# EasyEDA Pro project leaf_chaser.epro

# Schematic Schematic1
Board Name: Board1; Create Date: 2026-05-01; Page Name: P1; Project Name: leaf-chaser; Schematic Name: Schematic1; Update Date: 2026-05-01; Company: EasyEDA.com; Page Size: A4; Version: V1.0
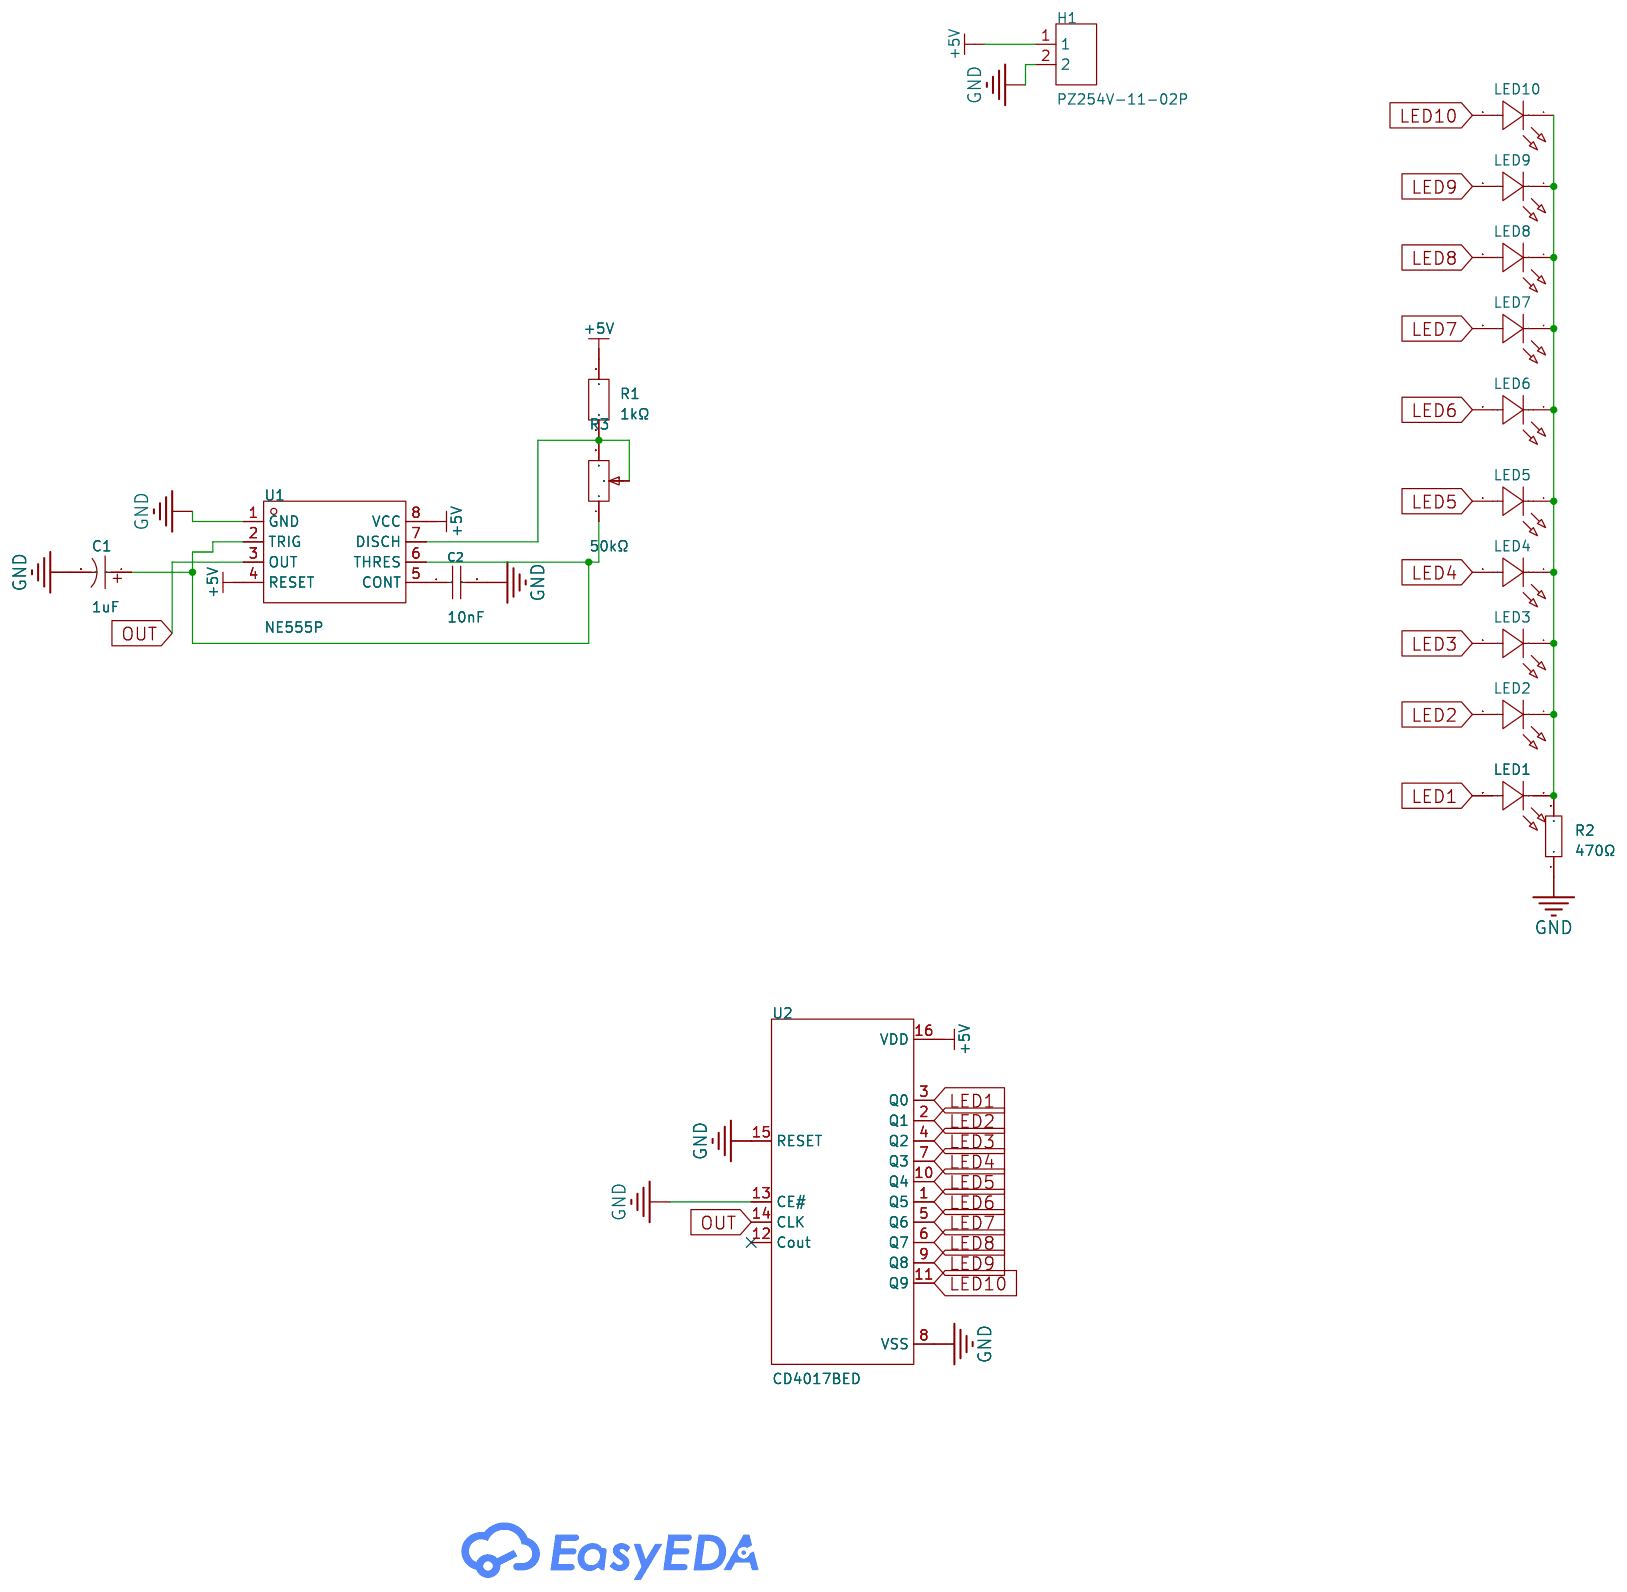
[diagram p0: schematic sheet]

## Parts
C1  1uF  [CAP-TH_BD4.0-P1.50-D0.8-FD]
C2  10nF  [C0603]
H1  PZ254V-11-02P  [HDR-TH_2P-P2.54-V-M]
LED1  XL-302SURD  [LED-TH_BD3.8-P2.54-RD]
LED2  XL-302SURD  [LED-TH_BD3.8-P2.54-RD]
LED3  XL-302SURD  [LED-TH_BD3.8-P2.54-RD]
LED4  XL-302SURD  [LED-TH_BD3.8-P2.54-RD]
LED5  XL-302SURD  [LED-TH_BD3.8-P2.54-RD]
LED6  XL-302SURD  [LED-TH_BD3.8-P2.54-RD]
LED7  XL-302SURD  [LED-TH_BD3.8-P2.54-RD]
LED8  XL-302SURD  [LED-TH_BD3.8-P2.54-RD]
LED9  XL-302SURD  [LED-TH_BD3.8-P2.54-RD]
LED10  XL-302SURD  [LED-TH_BD3.8-P2.54-RD]
R1  1kΩ  [RES-TH_BD2.7-L6.2-P10.20-D0.4]
R2  470Ω  [RES-TH_BD2.3-L6.5-P10.50-D0.5]
R3  50kΩ  [RES-ADJ-TH_3296W]
U1  NE555P  [DIP-8_L9.8-W6.6-P2.54-LS7.6-BL]
U2  CD4017BED  [PDIP-16_L19.7-W6.6-P2.54-LS7.6-BL]

## Library data of the parts
C1 = KS1H010MB070A00CV0: Capacitance:1uF Tolerance:±20% Tolerance:±20% Voltage Rating:50V Ripple Current:10mA@120Hz Equivalent Series Resistance(ESR):- Pin Spacing:1.5mm Diameter:4mm Height - Seated (Max):7mm Lifetime:1000hrs@105℃; LCSC Part Name: 1uF ±20% 50V; Supplier Part: C216323; Manufacturer: HUAWEI(华威集团); Supplier Footprint: 插件,D4xL7mm; JLCPCB Part Class: Extended Part; Datasheet: https://atta.szlcsc.com/upload/public/pdf/source/20180905/C271443_A6F66C79EF84E009A061F1FE7B9BC844.pdf; Supplier: LCSC; Tolerance: ±20%; Voltage Rating: 50V; Ripple Current: 10mA@120Hz; Pin Spacing: 1.5mm; Diameter: 4mm; Height - Seated (Max): 7mm; Lifetime: 1000hrs@105℃
C2 = CC0603KRX7R9BB103: Capacitance:10nF Tolerance:±10% Tolerance:±10% Voltage Rating:50V Temperature Coefficient:X7R; LCSC Part Name: 10nF ±10% 50V; Supplier Part: C100042; Manufacturer: YAGEO(国巨); Supplier Footprint: 0603; Datasheet: https://item.szlcsc.com/datasheet/CC0603KRX7R9BB103/101256.html; Supplier: LCSC; Tolerance: ±10%; Voltage Rating: 50V; Temperature Coefficient: X7R
H1 = PZ254V-11-02P: Pin Structure:1x2P Pitch:2.54mm Row Spacing:- Circluar Pins/Square Pins:Pin Header Mounting Type:Through Hole Number of Rows:1 Number of Pins:2P Current Rating:3A Voltage Rating (Max):250V Length of Mating Pin:6mm Insulation Height:2.5mm Length of End Con; LCSC Part Name: 1x2P 间距:2.54mm 方针 直插; Supplier Part: C492401; Manufacturer: XFCN(兴飞); Supplier Footprint: 插件,P=2.54mm; JLCPCB Part Class: Extended Part; Datasheet: https://item.szlcsc.com/datasheet/PZ254V-11-02P/502957.html; Supplier: LCSC; Pin Structure: 1x2P; Pitch: 2.54mm; Circluar Pins/Square Pins: Pin Header; Mounting Type: Through Hole; Number of Rows: 1; Number of Pins: 2P; Current Rating: 3A; Voltage Rating (Max): 250V; Length of Mating Pin: 6mm; Insulation Height: 2.5mm; Length of End Connection Pin: 3mm; Contact Material: Brass; Operating Temperature: -40℃~+105℃; Color: Black
LED1-LED10 = XL-302SURD: Lamp Holder Type:3mm Round Lens Illumination Color:Red Voltage - Forward(Vf):2.2V Voltage - Forward(Vf):2.2V Power(Watts):50mW Forward Current:20mA Wavelength - Dominant:620nm~630nm Wavelength - Dominant:620nm~630nm Peak Wavelength:625nm Diode Configurati; LCSC Part Name: 3mm圆形灯头 红色; Supplier Part: C2895470; Manufacturer: XINGLIGHT(成兴光); Supplier Footprint: 插件,D=3mm; JLCPCB Part Class: Extended Part; Datasheet: https://item.szlcsc.com/datasheet/XL-302SURD/3136185.html; Supplier: LCSC; Lamp Holder Type: 3mm Round Lens; Illumination Color: Red; Voltage - Forward(Vf): 2.2V; Power(Watts): 50mW; Forward Current: 20mA; Wavelength - Dominant: 620nm~630nm; Peak Wavelength: 625nm; Lens Color: Red Lens; Luminous Intensity: 1cd; Viewing Angle: 35°; Operating Temperature: -20℃~+85℃
R1 = MF1/4W-1K±1%-ST52: Type:Metal Film Resistor Resistance:1kΩ Tolerance:±1% Tolerance:±1% Voltage-Supply(Max):250V Power(Watts):250mW Temperature Coefficient:±100ppm/℃ Temperature Coefficient:±100ppm/℃ Operating Temperature:-55℃~+155℃ Operating Temperature:-55℃~+155℃; LCSC Part Name: 金属膜电阻 1kΩ ±1% 250mW; Supplier Part: C2903245; Manufacturer: VO(翔胜); Supplier Footprint: 插件,D2.7xL6.2mm; Datasheet: https://item.szlcsc.com/datasheet/MF1%252F4W-1K%25C2%25B11%2525-ST52/3158996.html; Supplier: LCSC; Type: Metal Film Resistor; Tolerance: ±1%; Voltage-Supply(Max): 250V; Power(Watts): 250mW; Temperature Coefficient: ±100ppm/℃; Operating Temperature: -55℃~+155℃
R2 = MF1/2WS-470Ω±1% T: Type:Metal Film Resistor Resistance:470Ω Tolerance:±1% Tolerance:±1% Voltage-Supply(Max):250V Power(Watts):500mW Temperature Coefficient:±100ppm/℃ Temperature Coefficient:±100ppm/℃ Operating Temperature:-55℃~+155℃ Operating Temperature:-55℃~+155℃; LCSC Part Name: 470Ω ±1% 500mW 金属膜电阻 小体积,p;-[[圆柱直插; Supplier Part: C129899; Manufacturer: CCO(千志电子); Supplier Footprint: 插件,D2.3xL6.5mm; JLCPCB Part Class: Extended Part; Datasheet: https://item.szlcsc.com/datasheet/MF1%252F2WS-470%25CE%25A9%25C2%25B11%2525%2520T/141186.html; Supplier: LCSC; Type: Metal Film Resistor; Tolerance: ±1%; Voltage-Supply(Max): 250V; Power(Watts): 500mW; Temperature Coefficient: ±100ppm/℃; Operating Temperature: -55℃~+155℃
R3 = 3296W-1-503LF_C49190466: Resistance:50kΩ Tolerance:±10% Tolerance:±10% Power(Watts):500mW Temperature Coefficient:±150ppm/℃ Temperature Coefficient:±150ppm/℃ Number of Turns:28; LCSC Part Name: 玻璃釉预调电位器; Supplier Part: C49190466; Manufacturer: JIERR(捷而瑞); Manufacturer Part: 3296W-1-503LF; Supplier Footprint: 插件-3P,9.5x4.9mm; Datasheet: https://item.szlcsc.com/datasheet/3296W-1-503LF/51587059.html; Supplier: LCSC; Tolerance: ±10%; Power(Watts): 500mW; Temperature Coefficient: ±150ppm/℃; Number of Turns: 28
U1 = NE555P: Timer Number:1 Voltage - Supply:4.5V~16V Voltage - Supply:4.5V~16V Output Current:200mA Supply Current:2mA Operating Temperature:0℃~+70℃ Operating Temperature:0℃~+70℃ Features:占空比可调振荡；复位功能; LCSC Part Name: 555精密定时器; Supplier Part: C46749; Manufacturer: TI(德州仪器); Supplier Footprint: DIP-8; JLCPCB Part Class: Extended Part; Datasheet: https://www.ti.com/cn/lit/gpn/ne555; Supplier: LCSC; Timer Number: 1; Voltage - Supply: 4.5V~16V; Output Current: 200mA; Supply Current: 2mA; Operating Temperature: 0℃~+70℃; Features: 占空比可调振荡；复位功能
U2 = CD4017BED: Supplier Part: C51898328; Manufacturer: GMIC(绿微); Supplier Footprint: DIP-16; JLCPCB Part Class: Extended Part; Datasheet: https://item.szlcsc.com/datasheet/CD4017BED/54583753.html; Supplier: LCSC

## Nets
+5V: H1.1 R1.2 U1.4(RESET) U1.8(VCC) U2.16(VDD)
GND: C1.2 C2.2 H1.2 R2.1 U1.1(GND) U2.8(VSS) U2.13(CE#) U2.15(RESET)
LED1: LED1.2(A) U2.3(Q0)
LED2: LED2.2(A) U2.2(Q1)
LED3: LED3.2(A) U2.4(Q2)
LED4: LED4.2(A) U2.7(Q3)
LED5: LED5.2(A) U2.10(Q4)
LED6: LED6.2(A) U2.1(Q5)
LED7: LED7.2(A) U2.5(Q6)
LED8: LED8.2(A) U2.6(Q7)
LED9: LED9.2(A) U2.9(Q8)
LED10: LED10.2(A) U2.11(Q9)
OUT: U1.3(OUT) U2.14(CLK)
$1N2053: C1.1 R3.1 U1.2(TRIG) U1.6(THRES)
$1N2105: C2.1 U1.5(CONT)
$1N2159: R1.1 R3.2 R3.3 U1.7(DISCH)
$1N2664: LED1.1(K) LED2.1(K) LED3.1(K) LED4.1(K) LED5.1(K) LED6.1(K) LED7.1(K) LED8.1(K) LED9.1(K) LED10.1(K) R2.2

Not connected (* = marked no-connect by the designer): U2 12(Cout)*

# Board PCB1
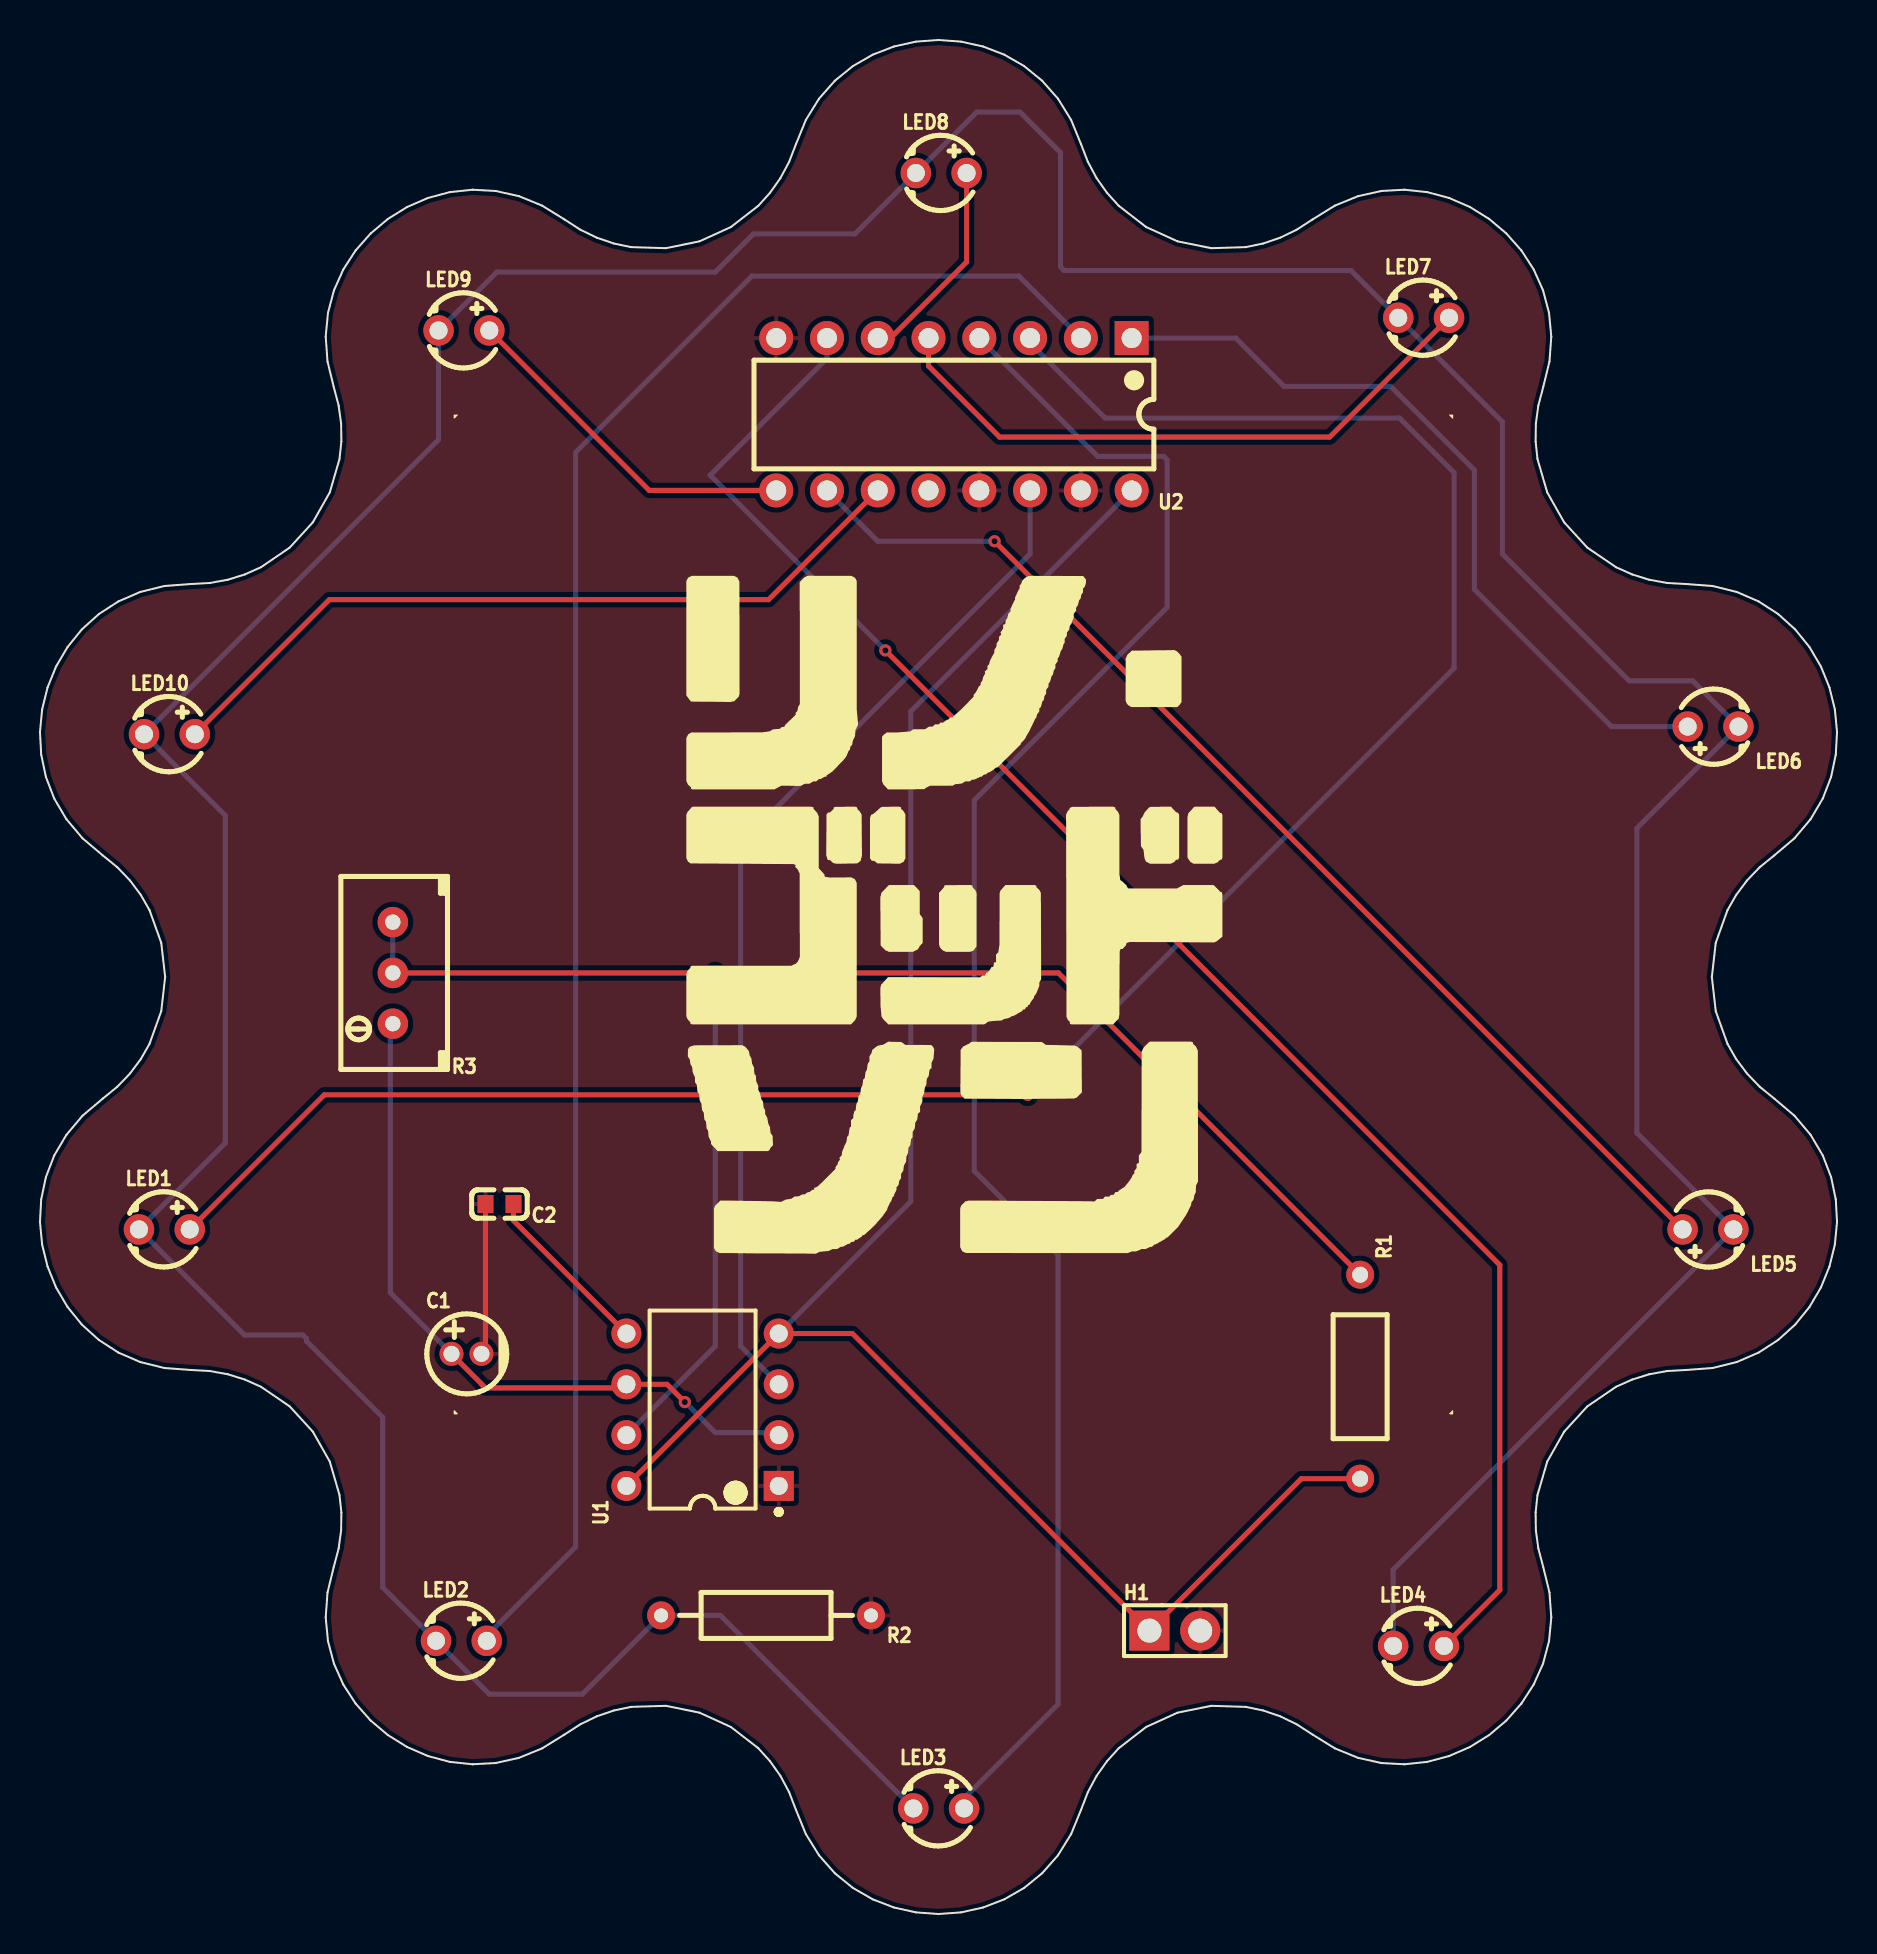
[diagram p1: board, top side]
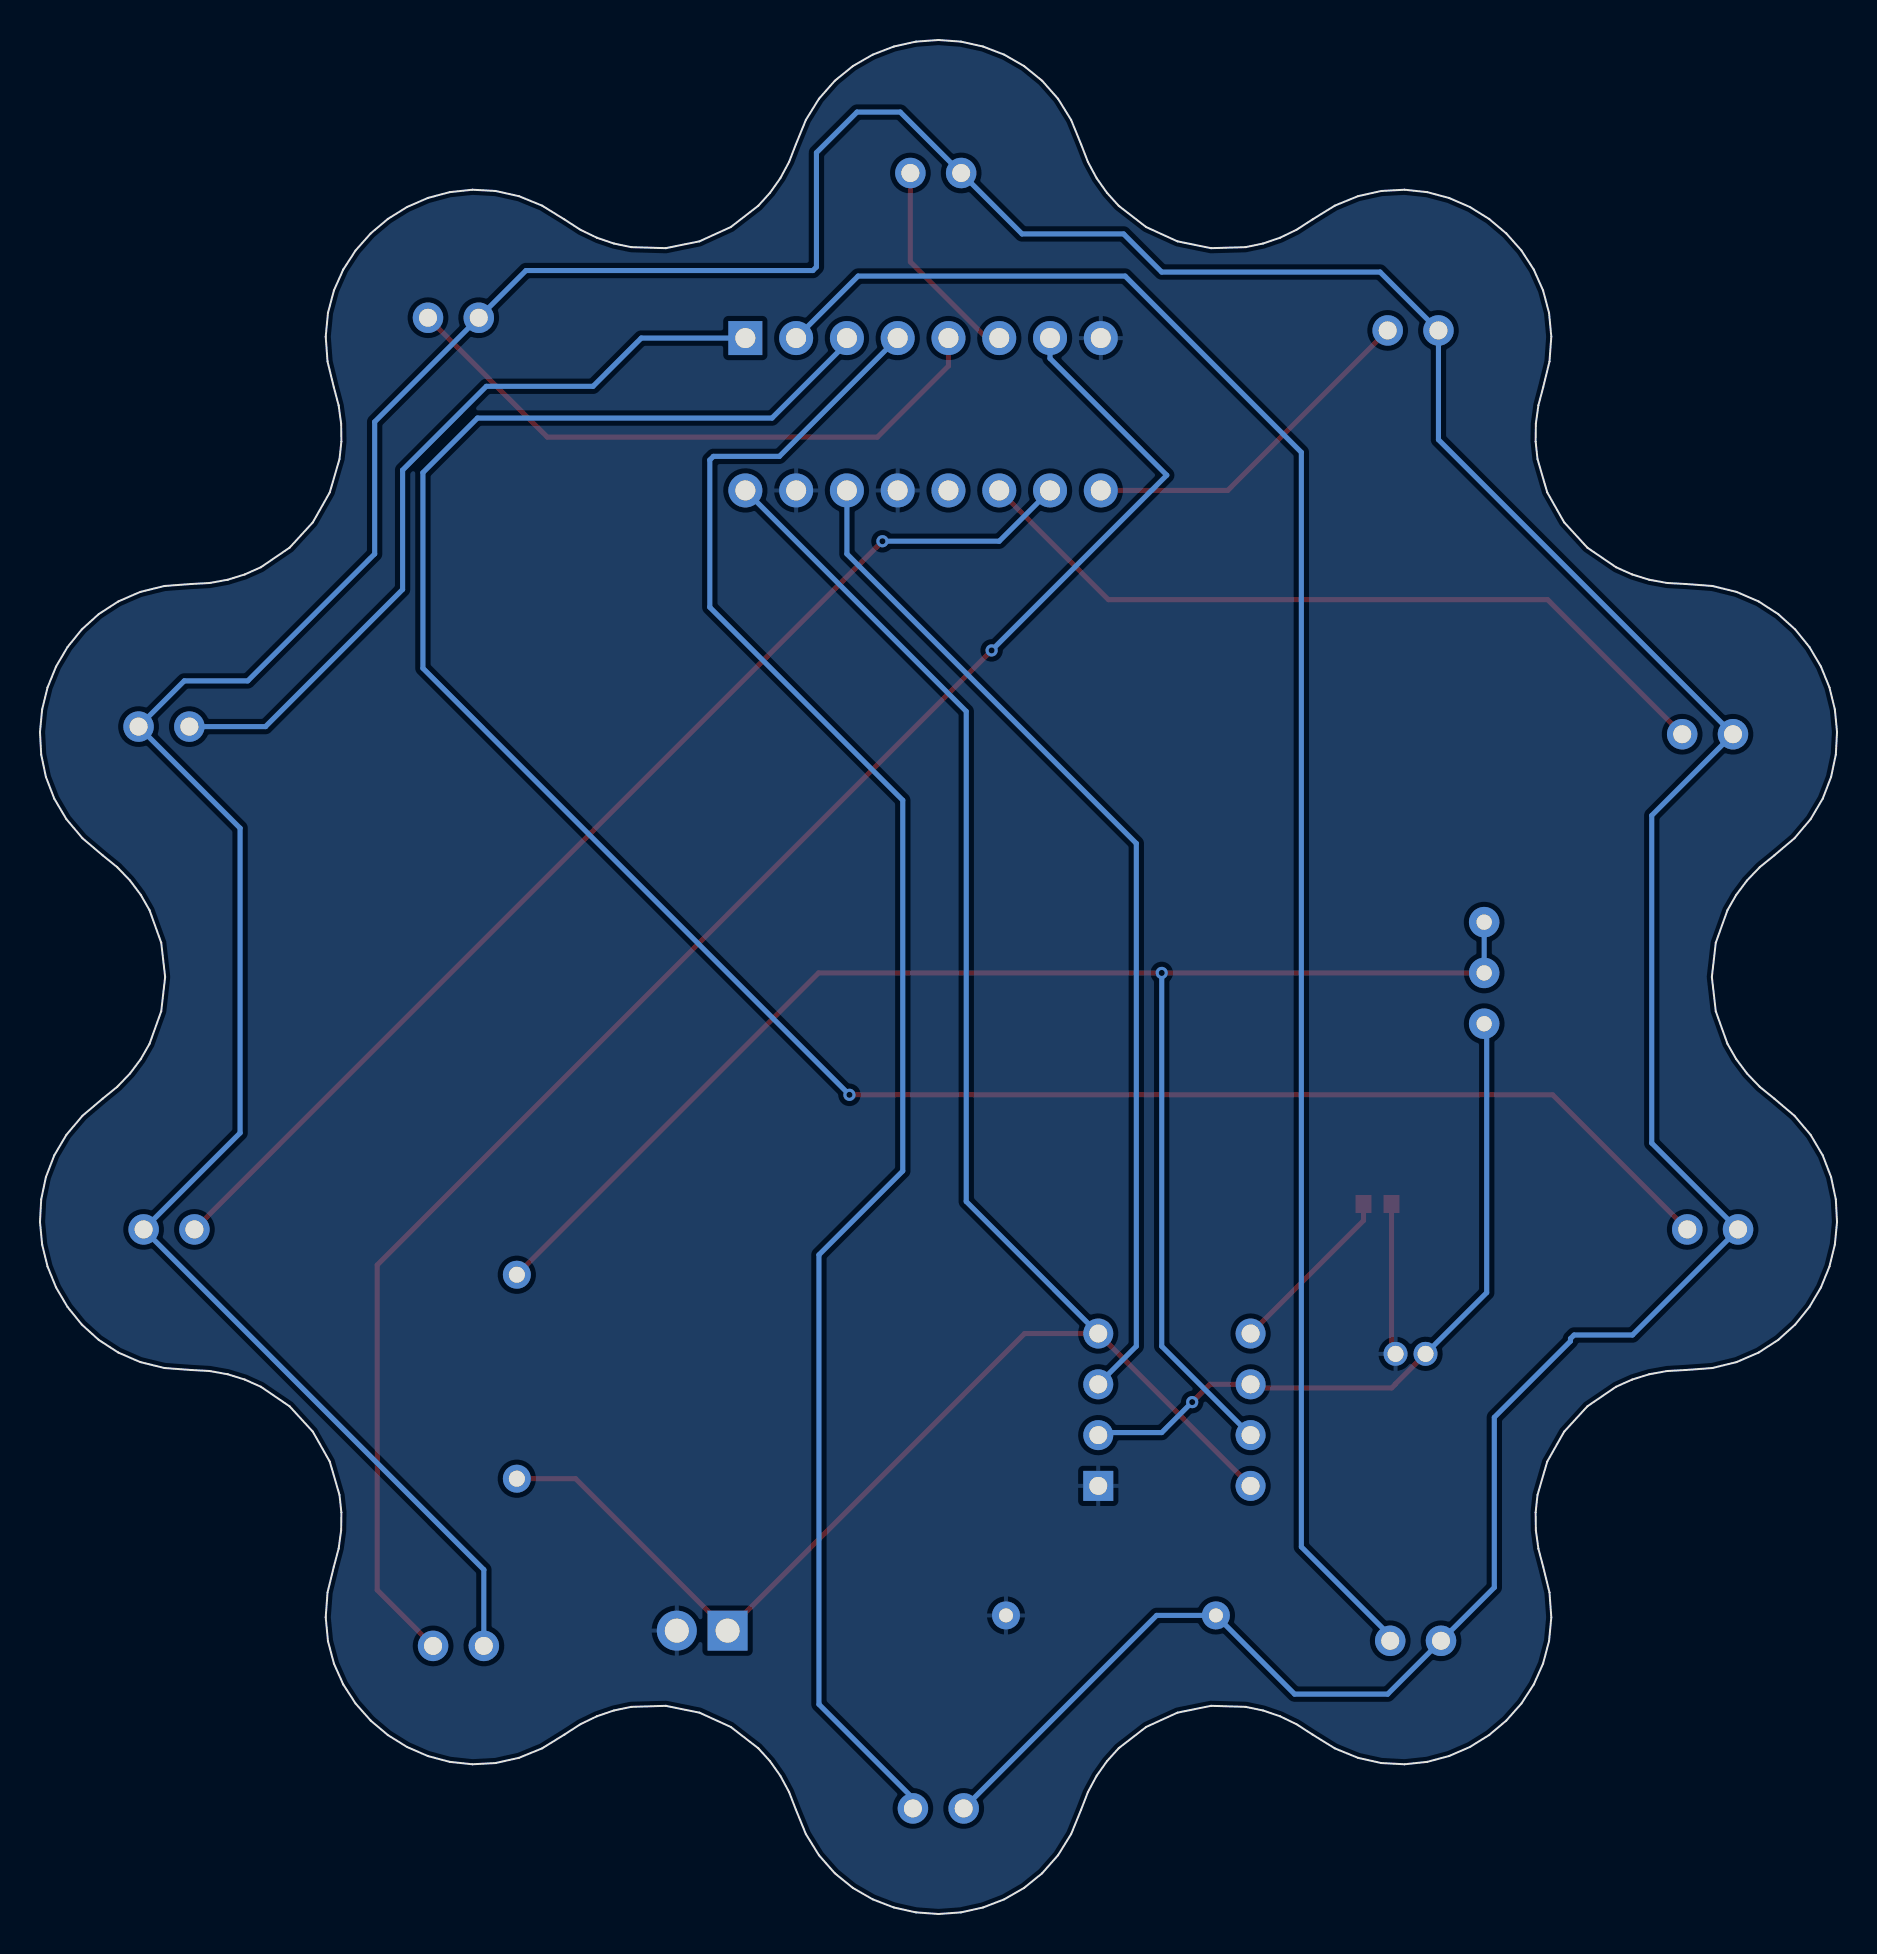
[diagram p2: board, bottom side, seen from below]

Outline 89.89 x 93.72 mm; copper layers: Top Layer, Bottom Layer. Coordinates in mm from the lower left corner of the outline.
Outline path: 0,59.12 0.11,60.24 0.38,61.34 0.8,62.39 1.38,63.36 2.09,64.24 2.94,65.01 3.92,65.64 5.02,66.12 6.23,66.42 7.55,66.51 8.49,66.56 9.39,66.73 10.25,66.99 11.05,67.35 12.49,68.33 13.65,69.6 14.5,71.1 14.98,72.76 15.08,73.64 15.06,74.54 14.94,75.44 14.7,76.36 14.38,77.64 14.29,78.88 14.41,80.07 14.7,81.2 15.17,82.24 15.79,83.2 16.54,84.04 17.4,84.77 18.36,85.37 19.4,85.82 20.49,86.11 21.63,86.23 22.8,86.17 23.96,85.91 25.12,85.44 26.24,84.74 27.03,84.23 27.86,83.83 28.71,83.54 29.57,83.36 31.31,83.31 32.99,83.65 34.56,84.37 35.93,85.43 36.52,86.08 37.04,86.81 37.47,87.62 37.81,88.5 38.31,89.73 38.97,90.79 39.76,91.68 40.66,92.42 41.66,92.99 42.72,93.39 43.82,93.64 44.95,93.72 46.07,93.64 47.18,93.39 48.24,92.99 49.23,92.42 50.13,91.68 50.92,90.79 51.58,89.73 52.08,88.5 52.42,87.62 52.85,86.81 53.37,86.08 53.96,85.43 55.34,84.37 56.9,83.65 58.59,83.31 60.32,83.36 61.18,83.54 62.03,83.83 62.86,84.23 63.65,84.74 64.78,85.44 65.93,85.91 67.1,86.17 68.26,86.23 69.4,86.11 70.49,85.82 71.53,85.37 72.49,84.77 73.35,84.04 74.1,83.2 74.72,82.24 75.19,81.2 75.49,80.07 75.6,78.88 75.51,77.64 75.19,76.36 74.95,75.44 74.83,74.54 74.82,73.64 74.91,72.76 75.4,71.1 76.24,69.6 77.41,68.33 78.84,67.35 79.64,66.99 80.5,66.73 81.4,66.56 82.35,66.51 83.66,66.42 84.88,66.12 85.97,65.64 86.95,65.01 87.8,64.24 88.51,63.36 89.09,62.39 89.51,61.34 89.78,60.24 89.89,59.12 89.83,57.99 89.6,56.86 89.18,55.78 88.57,54.75 87.76,53.8 86.75,52.94 86.02,52.35 85.39,51.69 84.85,50.97 84.41,50.2 83.83,48.57 83.63,46.86 83.83,45.15 84.41,43.52 84.85,42.75 85.39,42.03 86.02,41.37 86.75,40.78 87.76,39.92 88.57,38.97 89.18,37.94 89.6,36.86 89.83,35.74 89.89,34.6 89.78,33.48 89.51,32.38 89.09,31.33 88.51,30.36 87.8,29.48 86.95,28.71 85.97,28.08 84.88,27.6 83.66,27.31 82.35,27.21 81.4,27.16 80.5,26.99 79.64,26.73 78.84,26.37 77.41,25.39 76.24,24.12 75.4,22.62 74.91,20.96 74.82,20.08 74.83,19.18 74.95,18.28 75.19,17.36 75.51,16.08 75.6,14.84 75.49,13.65 75.19,12.52 74.72,11.48 74.1,10.52 73.35,9.68 72.49,8.95 71.53,8.35 70.49,7.9 69.4,7.61 68.26,7.49 67.1,7.55 65.93,7.81 64.78,8.28 63.65,8.98 62.86,9.49 62.03,9.89 61.18,10.18 60.32,10.36 58.59,10.41 56.9,10.07 55.34,9.35 53.96,8.29 53.37,7.64 52.85,6.91 52.42,6.1 52.08,5.22 51.58,4 50.92,2.94 50.13,2.04 49.23,1.3 48.24,0.73 47.18,0.33 46.07,0.08 44.95,0 43.82,0.08 42.72,0.33 41.66,0.73 40.66,1.3 39.76,2.04 38.97,2.94 38.31,4 37.81,5.22 37.47,6.1 37.04,6.91 36.52,7.64 35.93,8.29 34.56,9.35 32.99,10.07 31.31,10.41 29.57,10.36 28.71,10.18 27.86,9.89 27.03,9.49 26.24,8.98 25.12,8.28 23.96,7.81 22.8,7.55 21.63,7.49 20.49,7.61 19.4,7.9 18.36,8.35 17.4,8.95 16.54,9.68 15.79,10.52 15.17,11.48 14.7,12.52 14.41,13.65 14.29,14.84 14.38,16.08 14.7,17.36 14.94,18.28 15.06,19.18 15.08,20.08 14.98,20.96 14.5,22.62 13.65,24.12 12.49,25.39 11.05,26.37 10.25,26.73 9.39,26.99 8.49,27.16 7.55,27.21 6.23,27.31 5.02,27.6 3.92,28.08 2.94,28.71 2.09,29.48 1.38,30.36 0.8,31.33 0.38,32.38 0.11,33.48 0,34.6 0.06,35.74 0.3,36.86 0.71,37.94 1.32,38.97 2.13,39.92 3.14,40.78 3.87,41.37 4.5,42.03 5.04,42.75 5.48,43.52 6.07,45.15 6.26,46.86 6.07,48.57 5.48,50.2 5.04,50.97 4.5,51.69 3.87,52.35 3.14,52.94 2.13,53.8 1.32,54.75 0.71,55.78 0.3,56.86 0.06,57.99 0,59.12
Stack: Top Layer 0.035mm / Dielectric1 1.51mm FR4 er 4.5 / Bottom Layer 0.035mm

## Design rules (mm)
template: JLCPCB Capability(Two Layers Board)
spacing copperThickness1oz (default): track to track 0.102, other pairs 0.152 to 0.3
spacing copperThickness2oz: track to track 0.203, other pairs 0.152 to 0.3
track width copperThickness1oz (default): min 0.127, default 0.254, max 2.54
track width copperThickness2oz: min 0.203, default 0.254, max 2.54
differential pair differentialPair (default): width min 0.127, default 0.254, max 2.54; gap min 0.152, default 0.152
via viaSize (default): diameter min 0.5, default 0.61, max 10; hole min 0.3, default 0.305, max 6.3

## Placement (name value [footprint] x y rotation side)
C1  1uF  [CAP-TH_BD4.0-P1.50-D0.8-FD]  21.33 28.01 0 top
C2  10nF  [C0603]  22.98 35.51 180 top
H1  PZ254V-11-02P  [HDR-TH_2P-P2.54-V-M]  56.77 14.17 0 top
LED1  XL-302SURD  [LED-TH_BD3.8-P2.54-RD]  6.22 34.24 0 top
LED2  XL-302SURD  [LED-TH_BD3.8-P2.54-RD]  21.08 13.66 0 top
LED3  XL-302SURD  [LED-TH_BD3.8-P2.54-RD]  44.96 5.28 0 top
LED4  XL-302SURD  [LED-TH_BD3.8-P2.54-RD]  68.96 13.41 0 top
LED5  XL-302SURD  [LED-TH_BD3.8-P2.54-RD]  83.44 34.24 180 top
LED6  XL-302SURD  [LED-TH_BD3.8-P2.54-RD]  83.69 59.38 180 top
LED7  XL-302SURD  [LED-TH_BD3.8-P2.54-RD]  69.21 79.83 0 top
LED8  XL-302SURD  [LED-TH_BD3.8-P2.54-RD]  45.08 87.07 0 top
LED9  XL-302SURD  [LED-TH_BD3.8-P2.54-RD]  21.21 79.19 0 top
LED10  XL-302SURD  [LED-TH_BD3.8-P2.54-RD]  6.47 59 0 top
R1  1kΩ  [RES-TH_BD2.7-L6.2-P10.20-D0.4]  66.04 26.87 270 top
R2  470Ω  [RES-TH_BD2.3-L6.5-P10.50-D0.5]  36.32 14.93 180 top
R3  50kΩ  [RES-ADJ-TH_3296W]  17.65 47.06 180 top
U1  NE555P  [DIP-8_L9.8-W6.6-P2.54-LS7.6-BL]  33.14 25.22 90 top
U2  CD4017BED  [PDIP-16_L19.7-W6.6-P2.54-LS7.6-BL]  45.72 75 180 top

## Footprints (pads in the part's own frame, mm; a bottom-side part is the same pattern mirrored in y, then rotated)
C0603
  rect 0.8x0.9 smd: 1(-0.7,0) 2(0.7,0)
CAP-TH_BD4.0-P1.50-D0.8-FD
  round 1.2 hole 0.8: 1(-0.75,0) 2(0.75,0)
DIP-8_L9.8-W6.6-P2.54-LS7.6-BL
  rect 1.5x1.5 hole 0.9: 1(-3.81,-3.81)
  round 1.5 hole 0.9: 2(-1.27,-3.81) 3(1.27,-3.81) 4(3.81,-3.81) 5(3.81,3.81) 6(1.27,3.81) 7(-1.27,3.81) 8(-3.81,3.81)
HDR-TH_2P-P2.54-V-M
  rect 2x2 hole 1.2: 1(-1.27,0)
  round 2 hole 1.2: 2(1.27,0)
LED-TH_BD3.8-P2.54-RD
  round 1.524 hole 0.9: 1(-1.27,0) 2(1.27,0)
PDIP-16_L19.7-W6.6-P2.54-LS7.6-BL
  rect 1.7x1.7 hole 1: 1(-8.89,-3.81)
  round 1.7 hole 1: 2(-6.35,-3.81) 3(-3.81,-3.81) 4(-1.27,-3.81) 5(1.27,-3.81) 6(3.81,-3.81) 7(6.35,-3.81) 8(8.89,-3.81) 9(8.89,3.81) 10(6.35,3.81) 11(3.81,3.81) 12(1.27,3.81) 13(-1.27,3.81) 14(-3.81,3.81) 15(-6.35,3.81) 16(-8.89,3.81)
RES-ADJ-TH_3296W
  round 1.524 hole 0.762: 1(0,2.54) 2(0,0) 3(0,-2.54)
RES-TH_BD2.3-L6.5-P10.50-D0.5
  round 1.4 hole 0.7: 1(-5.25,0) 2(5.25,0)
RES-TH_BD2.7-L6.2-P10.20-D0.4
  round 1.4 hole 0.8: 1(-5.1,0) 2(5.1,0)

## Nets
As in the schematic.

Pads without a net: U2 12

## Via types
v1: diameter 0.61, hole 0.305, Top Layer to Bottom Layer, 5 vias

## Routing (per net, layer and track width the routed paths; a pad name or vN(x,y) marks a point on that pad's centre or on a via; arc(x,y) is an arc through that point)
+5V: length 98.6
  Top Layer w0.254: U1.8 U1.4 40.64,29.03 H1.1 63.1,21.77 R1.2
  Bottom Layer w0.254: 54.61,71.19 43.56,60.14 43.56,35.63 U1.4
GND: length 7.6
  Top Layer w0.254: C2.2 22.28,28.22 C1.2
LED1: length 108.8
  Top Layer w0.254: v1(49.4,40.97) 14.22,40.97 LED1.2
  Bottom Layer w0.254: U2.3 49.53,78.56 53.27,74.81 68.01,74.81 70.74,72.08 70.74,62.3 v1(49.4,40.97)
LED2: length 91.5
  Bottom Layer w0.254: U2.2 48.97,81.91 35.61,81.91 26.79,73.1 26.79,18.36 22.35,13.92 LED2.2
LED3: length 87
  Bottom Layer w0.254: U2.4 52.9,72.9 56.21,72.9 56.39,72.72 56.39,65.35 46.73,55.7 46.73,37.16 50.92,32.97 50.92,10.49 46.23,5.79 LED3.2
LED4: length 85.3
  Top Layer w0.254: v1(42.29,63.19) 73.02,32.46 73.02,16.2 LED4.2
  Bottom Layer w0.254: U2.7 39.37,77.8 33.53,71.96 v1(42.29,63.19)
LED5: length 58.1
  Top Layer w0.254: LED5.2 v1(47.75,68.65)
  Bottom Layer w0.254: U2.10 41.91,68.65 v1(47.75,68.65)
LED6: length 39.4
  Bottom Layer w0.254: LED6.2 78.61,59.38 71.75,66.24 71.75,72.21 67.56,76.4 62.23,76.4 59.81,78.81 54.61,78.81
LED7: length 31.4
  Top Layer w0.254: LED7.2 64.51,73.86 48,73.86 44.45,77.42 44.45,78.81
LED8: length 10.5
  Top Layer w0.254: U2.6 42.54,78.81 46.35,82.62 LED8.2
LED9: length 17.7
  Top Layer w0.254: LED9.2 30.48,71.19 U2.9
LED10: length 39.2
  Top Layer w0.254: LED10.2 14.48,65.73 36.45,65.73 U2.11
OUT: length 51.5
  Bottom Layer w0.254: U1.3 35.05,28.39 35.05,53.54 49.53,68.02 U2.14
$1N2053: length 36
  Top Layer w0.254: v1(32.26,25.6) 31.37,26.49 U1.6 29.16,26.31 22.28,26.31 22.1,26.49 22.1,26.5 C1.1
  Bottom Layer w0.254: R3.1 17.52,44.4 17.52,31.07 C1.1 ; v1(32.26,25.6) 33.78,24.08 36.83,24.08 U1.2
$1N2105: length 8.8
  Top Layer w0.254: C2.1 23.68,34.68 U1.5
$1N2159: length 82.1
  Top Layer w0.254: R3.2 v1(33.78,47.06) 50.94,47.06 R1.1
  Bottom Layer w0.254: v1(33.78,47.06) 33.78,28.39 U1.7 ; R3.3 R3.2
$1N2664: length 260.2
  Bottom Layer w0.254: LED4.1 67.69,17.22 LED5.1 79.88,39.06 79.88,54.3 LED6.1 82.67,61.67 79.5,61.67 73.15,68.02 73.15,74.62 LED7.1 65.58,82.19 51.23,82.19 51.05,82.37 51.05,88.08 49.02,90.12 46.86,90.12 LED8.1 40.76,84.02 35.69,84.02 33.78,82.12 22.86,82.12 LED9.1 19.94,73.73 LED10.1 9.27,54.94 9.27,38.55 LED1.1 10.23,28.96 13.15,28.96 13.33,28.78 13.33,28.65 17.14,24.84 17.14,16.33 22.48,11 27.13,11 R2.2 34.03,14.93 LED3.1

## Copper pours and planes (outline as drawn; the poured copper is in the pictures)
GND on Top Layer: -12.83,98.12 98.04,98.12 98.04,-6.91 -12.83,-6.91
GND on Bottom Layer: -13.46,99.77 97.91,99.77 97.91,-7.16 -13.46,-7.16
